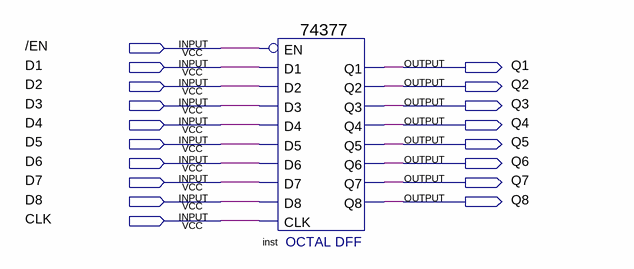
[diagram p0: schematic sheet]
// Quartus schematic A-REGISTER.bdf as structural Verilog: 1 symbols, 18 pins
module \A-REGISTER  (
  input  \/EN ,
  input  D1,
  input  D2,
  input  D3,
  input  D4,
  input  D5,
  input  D6,
  input  D7,
  input  D8,
  input  CLK,
  output Q1,
  output Q2,
  output Q3,
  output Q4,
  output Q5,
  output Q6,
  output Q7,
  output Q8
);

  \74377  inst (
    .D8(D8), .D7(D7), .CLK(CLK), .D2(D2), .EN(\/EN ), .D1(D1), .D6(D6), .D3(D3), .D4(D4), .D5(D5), .Q8(Q8),
    .Q7(Q7), .Q6(Q6), .Q5(Q5), .Q4(Q4), .Q3(Q3), .Q1(Q1), .Q2(Q2));
endmodule
